# EAGLE schematic spokepov (EAGLE 6.6.0)
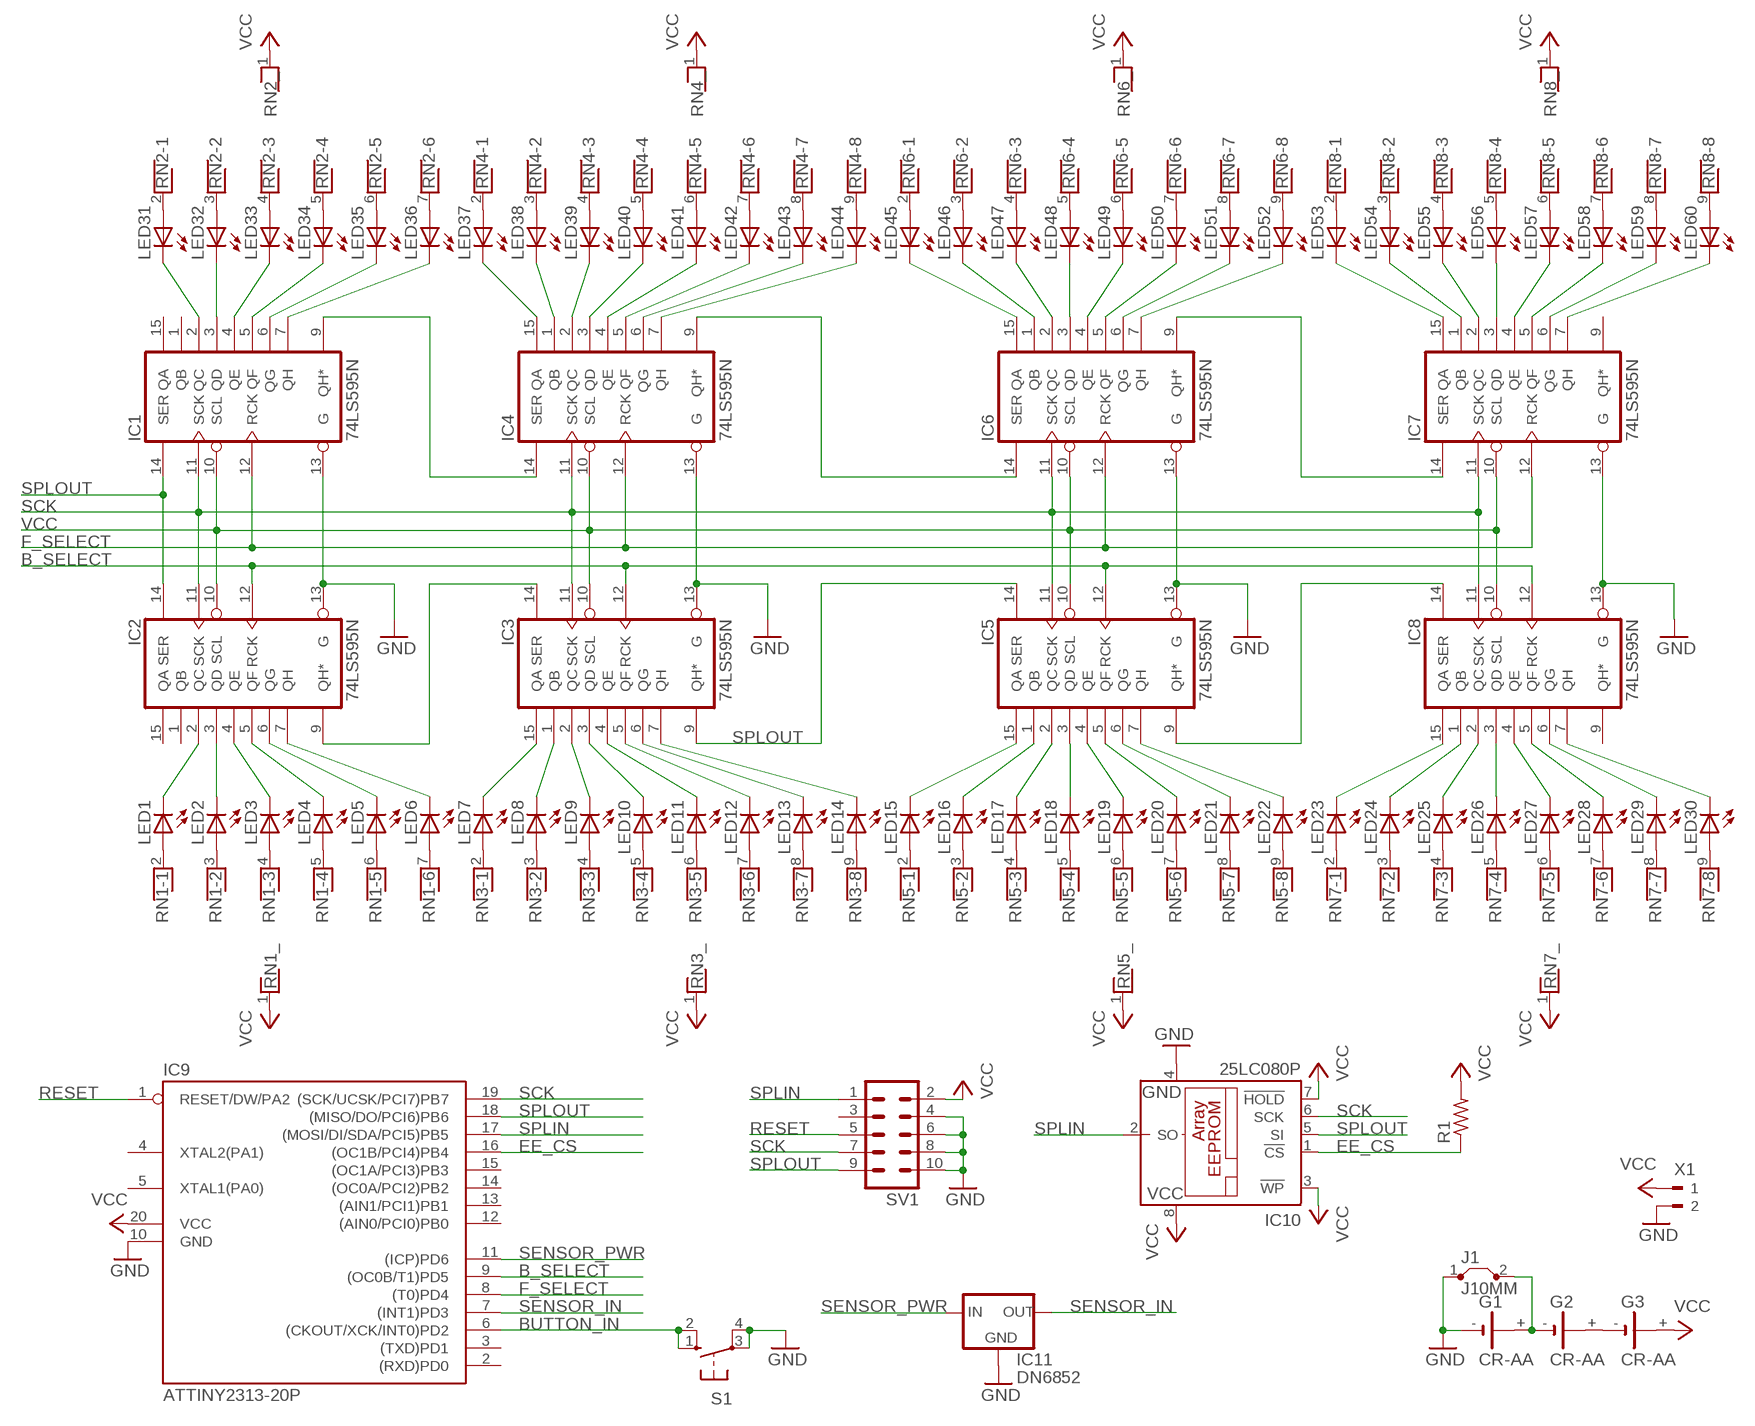
[diagram p0: schematic, sheet 1]

## Parts
G1  CR-AA  [CRAA]
G2  CR-AA  [CRAA]
G3  CR-AA  [CRAA]
IC1  74LS595N  [DIL16]
IC2  74LS595N  [DIL16]
IC3  74LS595N  [DIL16]
IC4  74LS595N  [DIL16]
IC5  74LS595N  [DIL16]
IC6  74LS595N  [DIL16]
IC7  74LS595N  [DIL16]
IC8  74LS595N  [DIL16]
IC9  ATTINY2313-20P  [DIL20]
IC10  25LC080P  [DIL8]
IC11  DN6852  78MXXS  [78MXXS]
J1  J10MM  [10]
LED1  LED5MM  [LED5MM]
LED2  LED5MM  [LED5MM]
LED3  LED5MM  [LED5MM]
LED4  LED5MM  [LED5MM]
LED5  LED5MM  [LED5MM]
LED6  LED5MM  [LED5MM]
LED7  LED5MM  [LED5MM]
LED8  LED5MM  [LED5MM]
LED9  LED5MM  [LED5MM]
LED10  LED5MM  [LED5MM]
LED11  LED5MM  [LED5MM]
LED12  LED5MM  [LED5MM]
LED13  LED5MM  [LED5MM]
LED14  LED5MM  [LED5MM]
LED15  LED5MM  [LED5MM]
LED16  LED5MM  [LED5MM]
LED17  LED5MM  [LED5MM]
LED18  LED5MM  [LED5MM]
LED19  LED5MM  [LED5MM]
LED20  LED5MM  [LED5MM]
LED21  LED5MM  [LED5MM]
LED22  LED5MM  [LED5MM]
LED23  LED5MM  [LED5MM]
LED24  LED5MM  [LED5MM]
LED25  LED5MM  [LED5MM]
LED26  LED5MM  [LED5MM]
LED27  LED5MM  [LED5MM]
LED28  LED5MM  [LED5MM]
LED29  LED5MM  [LED5MM]
LED30  LED5MM  [LED5MM]
LED31  LED5MM  [LED5MM]
LED32  LED5MM  [LED5MM]
LED33  LED5MM  [LED5MM]
LED34  LED5MM  [LED5MM]
LED35  LED5MM  [LED5MM]
LED36  LED5MM  [LED5MM]
LED37  LED5MM  [LED5MM]
LED38  LED5MM  [LED5MM]
LED39  LED5MM  [LED5MM]
LED40  LED5MM  [LED5MM]
LED41  LED5MM  [LED5MM]
LED42  LED5MM  [LED5MM]
LED43  LED5MM  [LED5MM]
LED44  LED5MM  [LED5MM]
LED45  LED5MM  [LED5MM]
LED46  LED5MM  [LED5MM]
LED47  LED5MM  [LED5MM]
LED48  LED5MM  [LED5MM]
LED49  LED5MM  [LED5MM]
LED50  LED5MM  [LED5MM]
LED51  LED5MM  [LED5MM]
LED52  LED5MM  [LED5MM]
LED53  LED5MM  [LED5MM]
LED54  LED5MM  [LED5MM]
LED55  LED5MM  [LED5MM]
LED56  LED5MM  [LED5MM]
LED57  LED5MM  [LED5MM]
LED58  LED5MM  [LED5MM]
LED59  LED5MM  [LED5MM]
LED60  LED5MM  [LED5MM]
R1  R-US_0207/10  [0207/10]
RN1  RNX8  [RN-9]
RN2  RNX8  [RN-9]
RN3  RNX8  [RN-9]
RN4  RNX8  [RN-9]
RN5  RNX8  [RN-9]
RN6  RNX8  [RN-9]
RN7  RNX8  [RN-9]
RN8  RNX8  [RN-9]
S1  10-XX  [B3F-10XX]
SV1  ML10  [ML10]
X1  90-2  [90-2]

## Nets
B_SELECT: IC2.12(RCK) IC3.12(RCK) IC5.12(RCK) IC8.12(RCK) IC9.9((OC0B/T1)PD5)
BUTTON_IN: IC9.6((CKOUT/XCK/INT0)PD2) S1.1(S) S1.2(S1)
EE_CS: IC9.16((OC1B/PCI4)PB4) IC10.1(!CS) R1.1
F_SELECT: IC1.12(RCK) IC4.12(RCK) IC6.12(RCK) IC7.12(RCK) IC9.8((T0)PD4)
GND: G1.- IC1.13(G) IC2.13(G) IC3.13(G) IC4.13(G) IC5.13(G) IC6.13(G) IC7.13(G) IC8.13(G) IC9.10(GND) IC10.4(GND) IC11.GND J1.1 S1.3(P) S1.4(P1) SV1.4 SV1.6 SV1.8 SV1.10 X1.2
N$1: IC7.15(QA) LED53.K(C)
N$2: IC7.1(QB) LED54.K(C)
N$3: IC7.2(QC) LED55.K(C)
N$4: IC7.3(QD) LED56.K(C)
N$5: IC7.4(QE) LED57.K(C)
N$6: IC7.5(QF) LED58.K(C)
N$7: IC2.2(QC) LED1.K(C)
N$8: IC2.3(QD) LED2.K(C)
N$9: IC2.4(QE) LED3.K(C)
N$10: IC2.5(QF) LED4.K(C)
N$11: IC2.6(QG) LED5.K(C)
N$12: IC2.7(QH) LED6.K(C)
N$13: LED1.A RN1.2
N$14: LED2.A RN1.3
N$15: LED3.A RN1.4
N$16: LED4.A RN1.5
N$17: LED5.A RN1.6
N$18: LED6.A RN1.7
N$19: LED7.A RN3.2
N$20: LED8.A RN3.3
N$21: LED9.A RN3.4
N$22: LED10.A RN3.5
N$23: LED11.A RN3.6
N$24: LED12.A RN3.7
N$25: LED13.A RN3.8
N$26: LED14.A RN3.9
N$27: LED15.A RN5.2
N$28: LED16.A RN5.3
N$29: LED17.A RN5.4
N$30: LED18.A RN5.5
N$31: LED19.A RN5.6
N$32: LED20.A RN5.7
N$33: LED21.A RN5.8
N$34: LED22.A RN5.9
N$35: LED23.A RN7.2
N$36: LED24.A RN7.3
N$37: LED25.A RN7.4
N$38: LED26.A RN7.5
N$39: LED27.A RN7.6
N$40: LED28.A RN7.7
N$41: LED29.A RN7.8
N$42: LED30.A RN7.9
N$43: IC1.2(QC) LED31.K(C)
N$44: IC1.3(QD) LED32.K(C)
N$45: IC1.4(QE) LED33.K(C)
N$46: IC1.5(QF) LED34.K(C)
N$47: IC1.6(QG) LED35.K(C)
N$48: IC1.7(QH) LED36.K(C)
N$49: LED31.A RN2.2
N$50: LED32.A RN2.3
N$51: LED33.A RN2.4
N$52: LED34.A RN2.5
N$53: LED35.A RN2.6
N$54: LED36.A RN2.7
N$55: LED37.A RN4.2
N$56: LED38.A RN4.3
N$57: LED39.A RN4.4
N$58: LED40.A RN4.5
N$59: LED41.A RN4.6
N$60: LED42.A RN4.7
N$61: LED43.A RN4.8
N$62: LED44.A RN4.9
N$63: LED45.A RN6.2
N$64: LED46.A RN6.3
N$65: LED47.A RN6.4
N$66: LED48.A RN6.5
N$67: LED49.A RN6.6
N$68: LED50.A RN6.7
N$69: LED51.A RN6.8
N$70: LED52.A RN6.9
N$71: LED53.A RN8.2
N$72: LED54.A RN8.3
N$73: LED55.A RN8.4
N$74: LED56.A RN8.5
N$75: LED57.A RN8.6
N$76: LED58.A RN8.7
N$77: LED59.A RN8.8
N$78: LED60.A RN8.9
N$79: IC3.15(QA) LED7.K(C)
N$80: IC3.1(QB) LED8.K(C)
N$81: IC3.2(QC) LED9.K(C)
N$82: IC3.3(QD) LED10.K(C)
N$83: IC3.4(QE) LED11.K(C)
N$84: IC3.5(QF) LED12.K(C)
N$85: IC3.6(QG) LED13.K(C)
N$86: IC3.7(QH) LED14.K(C)
N$87: IC5.15(QA) LED15.K(C)
N$88: IC5.1(QB) LED16.K(C)
N$89: IC5.2(QC) LED17.K(C)
N$90: IC5.3(QD) LED18.K(C)
N$91: IC5.4(QE) LED19.K(C)
N$92: IC5.5(QF) LED20.K(C)
N$93: IC5.6(QG) LED21.K(C)
N$94: IC5.7(QH) LED22.K(C)
N$95: IC8.15(QA) LED23.K(C)
N$96: IC8.1(QB) LED24.K(C)
N$97: IC8.2(QC) LED25.K(C)
N$98: IC8.3(QD) LED26.K(C)
N$99: IC8.7(QH) LED30.K(C)
N$100: IC8.6(QG) LED29.K(C)
N$101: IC8.5(QF) LED28.K(C)
N$102: IC8.4(QE) LED27.K(C)
N$103: IC7.6(QG) LED59.K(C)
N$104: IC7.7(QH) LED60.K(C)
N$105: IC6.7(QH) LED52.K(C)
N$106: IC6.15(QA) LED45.K(C)
N$107: IC6.1(QB) LED46.K(C)
N$108: IC6.2(QC) LED47.K(C)
N$109: IC6.3(QD) LED48.K(C)
N$110: IC6.4(QE) LED49.K(C)
N$111: IC6.5(QF) LED50.K(C)
N$112: IC6.6(QG) LED51.K(C)
N$113: IC4.15(QA) LED37.K(C)
N$114: IC4.1(QB) LED38.K(C)
N$115: IC4.2(QC) LED39.K(C)
N$116: IC4.3(QD) LED40.K(C)
N$117: IC4.4(QE) LED41.K(C)
N$118: IC4.5(QF) LED42.K(C)
N$119: IC4.6(QG) LED43.K(C)
N$120: IC4.7(QH) LED44.K(C)
N$121: G1.+ G2.- J1.2
N$122: IC1.9(QH*) IC4.14(SER)
N$123: IC2.9(QH*) IC3.14(SER)
N$124: IC5.9(QH*) IC8.14(SER)
N$125: IC4.9(QH*) IC6.14(SER)
N$126: G2.+ G3.-
N$127: IC6.9(QH*) IC7.14(SER)
RESET: IC9.1(RESET/DW/PA2) SV1.5
SCK: IC1.11(SCK) IC2.11(SCK) IC3.11(SCK) IC4.11(SCK) IC5.11(SCK) IC6.11(SCK) IC7.11(SCK) IC8.11(SCK) IC9.19((SCK/UCSK/PCI7)PB7) IC10.6(SCK) SV1.7
SENSOR_IN: IC9.7((INT1)PD3) IC11.OUT
SENSOR_PWR: IC9.11((ICP)PD6) IC11.IN
SPLIN: IC9.17((MOSI/DI/SDA/PCI5)PB5) IC10.2(SO) SV1.1
SPLOUT: IC1.14(SER) IC2.14(SER) IC3.9(QH*) IC5.14(SER) IC9.18((MISO/DO/PCI6)PB6) IC10.5(SI) SV1.9
VCC: G3.+ IC1.10(SCL) IC2.10(SCL) IC3.10(SCL) IC4.10(SCL) IC5.10(SCL) IC6.10(SCL) IC7.10(SCL) IC8.10(SCL) IC9.20(VCC) IC10.3(!WP) IC10.7(!HOLD) IC10.8(VCC) R1.2 RN1.1 RN2.1 RN3.1 RN4.1 RN5.1 RN6.1 RN7.1 RN8.1 SV1.2 X1.1
Unconnected: G1.+@1(+) G2.+@1(+) G3.+@1(+) IC1.1(QB) IC1.15(QA) IC2.1(QB) IC2.15(QA) IC7.9(QH*) IC8.9(QH*) IC9.2((RXD)PD0) IC9.3((TXD)PD1) IC9.4(XTAL2(PA1)) IC9.5(XTAL1(PA0)) IC9.12((AIN0/PCI0)PB0) IC9.13((AIN1/PCI1)PB1) IC9.14((OC0A/PCI2)PB2) IC9.15((OC1A/PCI3)PB3) RN1.8 RN1.9 RN2.8 RN2.9 SV1.3

## Power pins joined to a net without a drawn wire
GND: IC1.8(GND) IC2.8(GND) IC3.8(GND) IC4.8(GND) IC5.8(GND) IC6.8(GND) IC7.8(GND) IC8.8(GND)
VCC: IC1.16(VCC) IC2.16(VCC) IC3.16(VCC) IC4.16(VCC) IC5.16(VCC) IC6.16(VCC) IC7.16(VCC) IC8.16(VCC)

## Library data of the parts
G1-G3 = battery:CR-AA: LI BATTERY Varta CRAA-SLF
IC1-IC8 = 74xx-us:74*595: 8-bit SHIFT REGISTER, output latch
IC9 = avr:ATTINY2313: MICROCONTROLLER 2 Kbytes FLASH 128 bytes SRAM 128 bytes EEPROM USART USI
IC10 = microchip:25*: Serial EEPROM 4K/ 8K , SPI bus; MF: MICROCHIP; MPN: 25LC080/P; OC_FARNELL: 1556143; OC_NEWARK: 92C7440
IC11 = v-reg:78MXXS: VOLTAGE REGULATOR
J1 = jumper:J: Bridge
LED1-LED60 = led:LED: LED OSRAM: - CHIPLED LG R971, LG N971, LY N971, LG Q971, LY Q971, LO R971, LY R971 LH N974, LH R974 LS Q976, LO Q976, LY Q976 LO Q996 - Hyper CHIPLED LW Q18S LB Q993, LB Q99A, LB R99A - SideLED LS A670, LO A670, LY A670, LG A670, LP A670 LB A673, LV A673, LT A673, LW A673 LH A674 LY A675 LS A676, LA A676, LO A676, LY A676, LW A676 LS A679, LY A679, LG A679 - Hyper Micro SIDELED® LS Y876, LA Y876, LO Y876, LY Y876 LT Y87S - SmartLED LW L88C, LW L88S LB L89C, LB L89S, LG L890 LS L89K, LO L89K, LY L89K LS L896, LA L896, LO L896, LY L896 - TOPLED LS T670, LO T670, LY T670, LG T670, LP T670 LSG T670, LSP T670, LSY T670, LOP T670, LYG T670 LG T671, LOG T671, LSG T671 LB T673, LV T673, LT T673, LW T673 LH T674 LS T676, LA T676, LO T676, LY T676, LB T676, LH T676, LSB T676, LW T676 LB T67C, LV T67C, LT T67C, LS T67K, LO T67K, LY T67K, LW E67C LS E67B, LA E67B, LO E67B, LY E67B, LB E67C, LV E67C, LT E67C LW T67C LS T679, LY T679, LG T679 LS T770, LO T770, LY T770, LG T770, LP T770 LB T773, LV T773, LT T773, LW T773 LH T774 LS E675, LA E675, LY E675, LS T675 LS T776, LA T776, LO T776, LY T776, LB T776 LHGB T686 LT T68C, LB T68C - Hyper Mini TOPLED® LB M676 - Mini TOPLED Santana® LG M470 LS M47K, LO M47K, LY M47K Source: http://www.osram.convergy.de LUXEON: - LUMILED® LXK2-PW12-R00, LXK2-PW12-S00, LXK2-PW14-U00, LXK2-PW14-V00 LXK2-PM12-R00, LXK2-PM12-S00, LXK2-PM14-U00 LXK2-PE12-Q00, LXK2-PE12-R00, LXK2-PE12-S00, LXK2-PE14-T00, LXK2-PE14-U00 LXK2-PB12-K00, LXK2-PB12-L00, LXK2-PB12-M00, LXK2-PB14-N00, LXK2-PB14-P00, LXK2-PB14-Q00 LXK2-PR12-L00, LXK2-PR12-M00, LXK2-PR14-Q00, LXK2-PR14-R00 LXK2-PD12-Q00, LXK2-PD12-R00, LXK2-PD12-S00 LXK2-PH12-R00, LXK2-PH12-S00 LXK2-PL12-P00, LXK2-PL12-Q00, LXK2-PL12-R00 Source: www.luxeon.com KINGBRIGHT: KA-3528ASYC Source: www.kingbright.com
R1 = rcl:R-US_: RESISTOR, American symbol
RN1-RN8 = resistor-net:RNX8: RESISTOR NETWORK; OC_FARNELL: unknown; OC_NEWARK: unknown
S1 = switch-omron:10-XX: OMRON SWITCH; MPN: B3F-1000; OC_FARNELL: 176432; OC_NEWARK: 36M3542
SV1 = con-harting-ml:ML10: HARTING; OC_FARNELL: unknown; OC_NEWARK: unknown
X1 = con-weidmueller-sl35:90-2: WEIDMUELLER CLAMP CONNECTOR; OC_FARNELL: unknown; OC_NEWARK: unknown